# Altium schematic sheet Sheet1.SchDoc
size A3; SheetNumber: 1; SheetTotal: 1
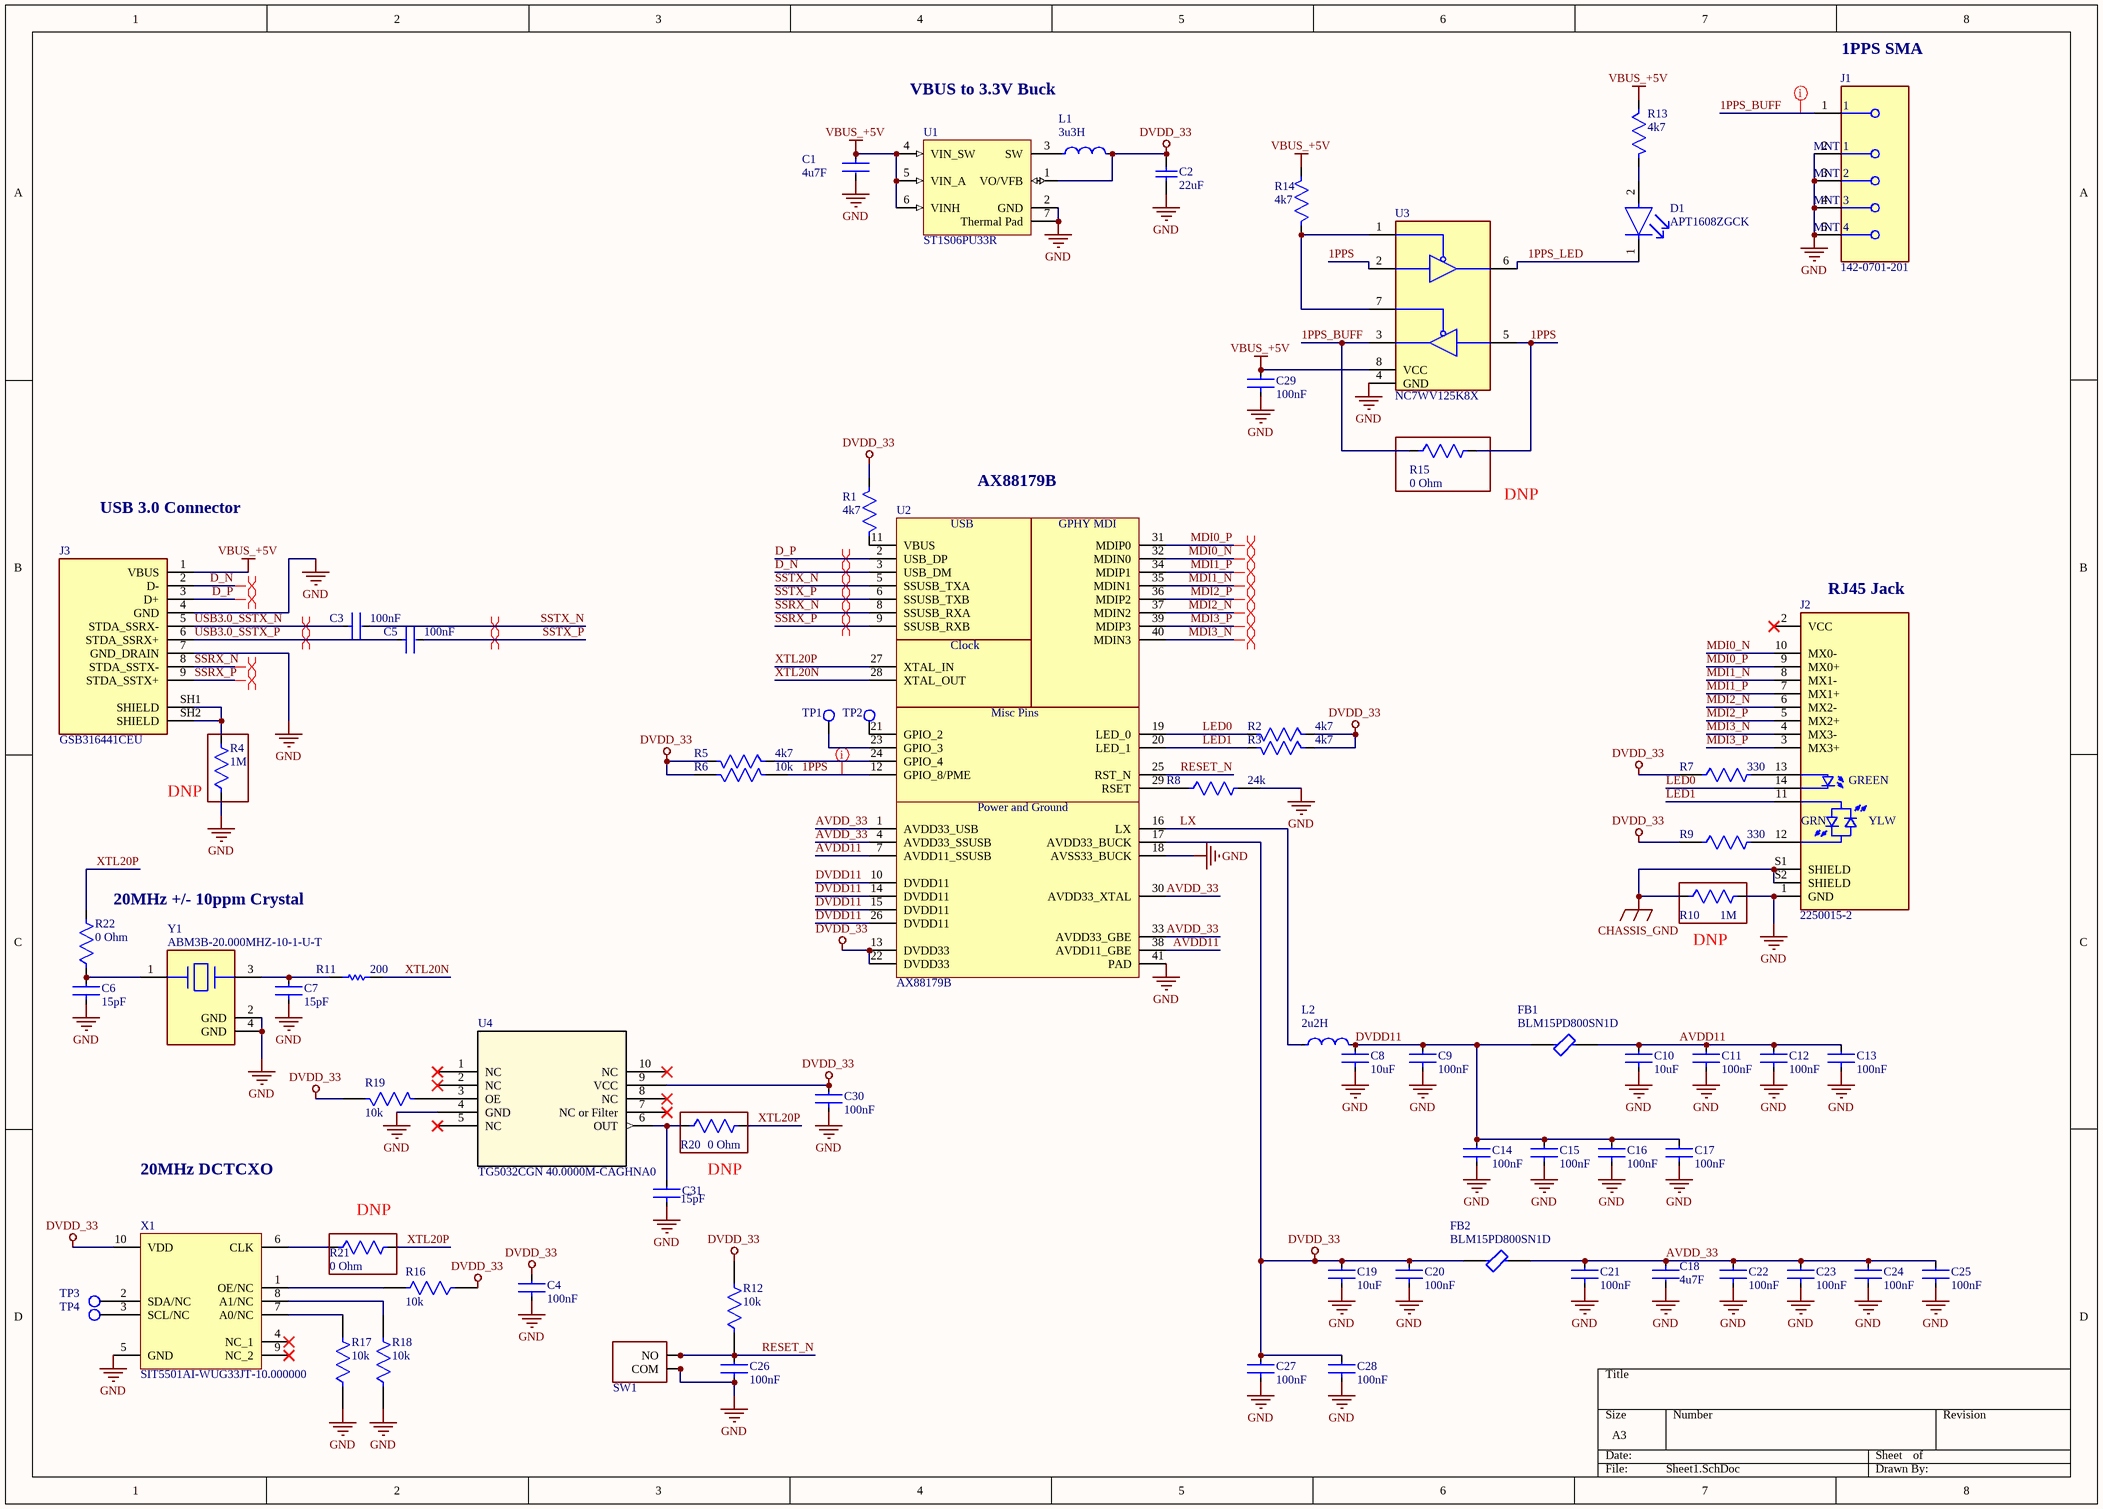
[diagram p0: Sheet1.SchDoc]

## Parts
C1  4u7F  [FP-0402-L_1_0_0_15-W_0_5-IPC_C]
C2  22uF  [CAPC1608X100X20ML10]
C3  100nF  [FP-CL251-IPC_C]
C4  100nF  [FP-CL251-IPC_C]
C5  100nF  [FP-CL251-IPC_C]
C6  15pF  [FP-CBR04C-MFG]
C7  15pF  [FP-CBR04C-MFG]
C8  10uF  [FP-CL05A106MP5NUNC-MFG]
C9  100nF  [FP-CL251-IPC_C]
C10  10uF  [FP-CL05A106MP5NUNC-MFG]
C11  100nF  [FP-CL251-IPC_C]
C12  100nF  [FP-CL251-IPC_C]
C13  100nF  [FP-CL251-IPC_C]
C14  100nF  [FP-CL251-IPC_C]
C15  100nF  [FP-CL251-IPC_C]
C16  100nF  [FP-CL251-IPC_C]
C17  100nF  [FP-CL251-IPC_C]
C18  4u7F  [FP-0402-L_1_0_0_15-W_0_5-IPC_C]
C19  10uF  [FP-CL05A106MP5NUNC-MFG]
C20  100nF  [FP-CL251-IPC_C]
C21  100nF  [FP-CL251-IPC_C]
C22  100nF  [FP-CL251-IPC_C]
C23  100nF  [FP-CL251-IPC_C]
C24  100nF  [FP-CL251-IPC_C]
C25  100nF  [FP-CL251-IPC_C]
C26  100nF  [FP-CL251-IPC_C]
C27  100nF  [FP-CL251-IPC_C]
C28  100nF  [FP-CL251-IPC_C]
C29  100nF  [FP-CL251-IPC_C]
C30  100nF  [FP-CL251-IPC_C]
C31  15pF  [FP-CBR04C-MFG]
D1  APT1608ZGCK  [FP-APT1608ZGCK-MFG]
FB1  BLM15PD800SN1D  [FP-BLM15-0_05-MFG]
FB2  BLM15PD800SN1D  [FP-BLM15-0_05-MFG]
J1  142-0701-201  [FP-142-0701-201-MFG]
J2  2250015-2  [CONN_2250015-2]
J3  GSB316441CEU  [CONN_AMPHENOL_GSB316441CEU]
L1  3u3H  [FP-LQM2HPN_G0-IPC_A]
L2  2u2H  [FP-MLZ2012-0_85-IPC_A]
R1  4k7  [FP-RT0402-MFG]
R2  4k7  [FP-RT0402-MFG]
R3  4k7  [FP-RT0402-MFG]
R4  1M  [FP-RMCF0402-MFG]  (no BOM)
R5  4k7  [FP-RT0402-MFG]
R6  10k  [FP-RMCF0402-IPC_C]
R7  330  [FP-RC1005-IPC_B]
R8  24k  [FP-RT0402-MFG]
R9  330  [FP-RC1005-IPC_B]
R10  1M  [FP-RMCF0402-MFG]  (no BOM)
R11  200  [RESC1005X40X25LL10T10]
R12  10k  [FP-RMCF0402-IPC_C]
R13  4k7  [FP-RT0402-MFG]
R14  4k7  [FP-RT0402-MFG]
R15  0 Ohm  [FP-CR0402-IPC_B]  (no BOM)
R16  10k  [FP-RMCF0402-IPC_C]
R17  10k  [FP-RMCF0402-IPC_C]
R18  10k  [FP-RMCF0402-IPC_C]
R19  10k  [FP-RMCF0402-IPC_C]
R20  0 Ohm  [FP-CR0402-IPC_B]  (no BOM)
R21  0 Ohm  [FP-CR0402-IPC_B]  (no BOM)
R22  0 Ohm  [FP-CR0402-IPC_B]
SW1  SW_PTS815_SJG_250_SMTR_LFS  [SW_PTS815SJG250SMTRLFS]  (value not drawn)
TP1  Test Point 1MM  [TP_PAD-1MM]  (value not drawn)  (no BOM)
TP2  Test Point 1MM  [TP_PAD-1MM]  (value not drawn)  (no BOM)
TP3  Test Point 1MM  [TP_PAD-1MM]  (value not drawn)  (no BOM)
TP4  Test Point 1MM  [TP_PAD-1MM]  (value not drawn)  (no BOM)
U1  ST1S06PU33R  [DFN6D_L]
U2  AX88179B  [IC_AX88179B_QFN40_5X5]
U3  NC7WV125K8X  [SOP50P310X90-8N]
U4  TG5032CGN 40.0000M-CAGHNA0  [QFN10_TG5032CGN 40.0000M-CAGHNA0_EPS]
X1  SIT5501AI-WUG33JT-10.000000  [XTAL_SiT5501_70x50]
Y1  ABM3B-20.000MHZ-10-1-U-T  [FP-ABM3B-MFG]

## Nets
CHASSIS_GND: J2.S1(SHIELD) J2.S2(SHIELD) R10.1
DVDD_33: C2.2 C4.2 C19.2 C20.2 C27.2 C28.2 C30.2 FB2.1 L1.2 R1.2 R2.1 R3.1 R5.2 R6.1 R7.1 R9.1 R12.2 R16.1 R19.1 U1.1(VO/VFB) U2.13(DVDD33) U2.17(AVDD33_BUCK) U2.22(DVDD33) U4.9(VCC) X1.10(VDD)
GND: C1.1 C2.1 C4.1 C6.2 C7.2 C8.1 C9.1 C10.1 C11.1 C12.1 C13.1 C14.1 C15.1 C16.1 C17.1 C18.1 C19.1 C20.1 C21.1 C22.1 C23.1 C24.1 C25.1 C26.1 C27.1 C28.1 C29.1 C30.1 C31.2 J1.2(MNT_1) J1.3(MNT_2) J1.4(MNT_3) J1.5(MNT_4) J2.1(GND) J3.4(GND) J3.7(GND_DRAIN) R4.1 R8.2 R10.2 R17.1 R18.1 SW1.1(COM) SW1.2(COM) U1.2(GND) U1.7(Thermal_Pad) U2.18(AVSS33_BUCK) U2.41(PAD) U3.4(GND) U4.4(GND) X1.5(GND) Y1.2(GND) Y1.4(GND)
VBUS_+5V: C1.2 C29.2 J3.1(VBUS) R13.1 R14.2 U1.4(VIN_SW) U1.5(VIN_A) U1.6(VINH) U3.8(VCC)
1PPS: R6.2 R15.2 U2.12(GPIO_8/PME) U3.2 U3.5
1PPS_BUFF: J1.1 R15.1 U3.3
1PPS_LED: D1.1(C) U3.6
AVDD11: C10.2 C11.2 C12.2 C13.2 FB1.2 U2.7(AVDD11_SSUSB) U2.38(AVDD11_GBE)
AVDD_33: C18.2 C21.2 C22.2 C23.2 C24.2 C25.2 FB2.2 U2.1(AVDD33_USB) U2.4(AVDD33_SSUSB) U2.30(AVDD33_XTAL) U2.33(AVDD33_GBE)
D_N: J3.2(D-) U2.3(USB_DM)
D_P: J3.3(D+) U2.2(USB_DP)
DVDD11: C8.2 C9.2 C14.2 C15.2 C16.2 C17.2 FB1.1 L2.2 U2.10(DVDD11) U2.14(DVDD11) U2.15(DVDD11) U2.26(DVDD11)
LED0: J2.14(GK) R2.2 U2.19(LED_0)
LED1: J2.11 R3.2 U2.20(LED_1)
LX: L2.1 U2.16(LX)
MDI0_N: J2.10(MX0-) U2.32(MDIN0)
MDI0_P: J2.9(MX0+) U2.31(MDIP0)
MDI1_N: J2.8(MX1-) U2.35(MDIN1)
MDI1_P: J2.7(MX1+) U2.34(MDIP1)
MDI2_N: J2.6(MX2-) U2.37(MDIN2)
MDI2_P: J2.5(MX2+) U2.36(MDIP2)
MDI3_N: J2.4(MX3-) U2.40(MDIN3)
MDI3_P: J2.3(MX3+) U2.39(MDIP3)
RESET_N: C26.2 R12.1 SW1.3(NO) SW1.4(NO) U2.25(RST_N)
SSRX_N: J3.8(STDA_SSTX-) U2.8(SSUSB_RXA)
SSRX_P: J3.9(STDA_SSTX+) U2.9(SSUSB_RXB)
SSTX_N: C3.2 U2.5(SSUSB_TXA)
SSTX_P: C5.2 U2.6(SSUSB_TXB)
USB3.0_SSTX_N: C3.1 J3.5(STDA_SSRX-)
USB3.0_SSTX_P: C5.1 J3.6(STDA_SSRX+)
XTL20N: R11.2 U2.28(XTAL_OUT)
XTL20P: R20.2 R21.2 R22.2 U2.27(XTAL_IN)
NetC6_1: C6.1 R22.1 Y1.1
NetC7_1: C7.1 R11.1 Y1.3
NetC31_1: C31.1 R20.1 U4.6(OUT)
NetD1_2: D1.2(A) R13.2
NetJ2_12: J2.12 R9.2
NetJ2_13: J2.13(GA) R7.2
NetJ3_SH1: J3.SH1(SHIELD) J3.SH2(SHIELD) R4.2
NetL1_1: L1.1 U1.3(SW)
NetR1_1: R1.1 U2.11(VBUS)
NetR5_1: R5.1 U2.24(GPIO_4)
NetR8_1: R8.1 U2.29(RSET)
NetR14_1: R14.1 U3.1 U3.7
NetR16_2: R16.2 X1.1(OE/NC)
NetR17_2: R17.2 X1.7(A0/NC)
NetR18_2: R18.2 X1.8(A1/NC)
NetR19_2: R19.2 U4.3(OE)
NetR21_1: R21.1 X1.6(CLK)
NetTP1_1: TP1.1 U2.23(GPIO_3)
NetTP2_1: TP2.1 U2.21(GPIO_2)
NetTP3_1: TP3.1 X1.2(SDA/NC)
NetTP4_1: TP4.1 X1.3(SCL/NC)

Not connected (* = marked no-connect by the designer): J2 2(VCC)*; U4 1(NC)* 2(NC)* 5(NC)* 7(NC_or_Filter)* 8(NC)* 10(NC)*; X1 4(NC_1)* 9(NC_2)*

## Layout directives
differential pair: D_N, D_P, SSRX_N, SSRX_P, SSTX_N, SSTX_P
differential pair; differential pair class MDI: MDI0_N, MDI0_P, MDI1_N, MDI1_P, MDI2_N, MDI2_P, MDI3_N, MDI3_P
differential pair; differential pair class USB: D_N, D_P, SSRX_N, SSRX_P, SSTX_N, SSTX_P, USB3.0_SSTX_N, USB3.0_SSTX_P
net class PPS_S50: 1PPS, 1PPS_BUFF

## Notes on the sheet
- VBUS to 3.3V Buck
- 1PPS SMA
- USB 3.0 Connector
- AX88179B
- (near R15) DNP
- (near J2) RJ45 Jack
- (near R4) DNP
- (near R22) 20MHz +/- 10ppm Crystal
- (near R10) DNP
- 20MHz DCTCXO
- DNP
- (near R21) DNP
- (in symbol CONN_2250015-2) GREEN; GRN; YLW
- (in symbol IC_AX88179B) USB; GPHY MDI; Clock; Misc Pins; Power and Ground

## Library data of the parts
C1 C18 = CMP-14477-004104-2: Ceramic Capacitor General Use 4.7uF ±20% 10V X5R 0402; Manufacturer: Taiyo Yuden; Manufacturer Part Number: LMK105BBJ475MVLF; Material: 4241ConductorMaterial; Case Code (Metric): 1005; Package Quantity: 10000; Max Operating Temperature: 85°C; Halogen Free: Halogen Free; Case Code (Imperial): 0402; Weight: 2.3E-05oz; Packaging: Tape and Reel; Resistor Type: Ceramic; Width: 0.02inch; Case/Package: 0402; Min Operating Temperature: -55°C; Dielectric: X5R; Length: 1mm; RoHS Compliant: Yes; Capacitance: 4.7uF; Thickness: 0.022inch; Termination: SMD/SMT; Voltage Rating (DC): 10V; Voltage Rating: 10V; Mount: Surface Mount; Tolerance: 20%; Height: 0.5mm; Supplier: Digikey; Supplier Part Number: 587-3408-1-ND; RoHS: Yes; Category: Ceramic Capacitors; Stock: 753964; Pricing: 1=0.19, 10=0.12, 50=0.076, 100=0.0607, 500=0.04386, 1000=0.03879, 2500=0.03711, 5000=0.03373 (USD); Mounting Technology: Surface Mount; Value: 4.7uF; Series: M; Construction: Flat; ComponentLink1URL: https://datasheet.ciiva.com/24462/423lmk105bbj475mvlf-24462535.pdf?src-supplier=Onlinecomponents.com; ComponentLink1Description: https://datasheet.ciiva.com/24462/423lmk105bbj475mvlf-24462535.pdf?src-supplier=Onlinecomponents.com; ComponentLink2URL: https://datasheet.ciiva.com/18697/mlcc-all-e-18697686.pdf?src-supplier=Digikey; ComponentLink2Description: https://datasheet.ciiva.com/18697/mlcc-all-e-18697686.pdf?src-supplier=Digikey; ComponentLink3URL: https://datasheet.ciiva.com/18697/mlcc-all-e-18697685.pdf?src-supplier=Digikey; ComponentLink3Description: https://datasheet.ciiva.com/18697/mlcc-all-e-18697685.pdf?src-supplier=Digikey
C2 = CMP-2000-05441-1: Chip Capacitor, 22 uF, +/- 20%, 10 V, -55 to 85 degC, 0603 (1608 Metric), RoHS, Tape and Reel; Manufacturer: TDK; PCN Part Number: MLCCPartNumberChange30/Nov/2012; Manufacturer Part Number: C1608X5R1A226M080AC; Voltage - Rated: 10V; Product Training Modules: CSeriesGeneralApplicationsSEAT,CCV,andTVCLDesignToolsGuidetoReplacinganElectrolyticCapacitorwithanMLCC; Other Names: 445-9077-1; Design Resources: 20WNon-IsolatedBuckLEDDriverUsingPLLNK460KG; Online Catalog: CSeries,GeneralPurpose; Capacitance: 22µF; Temperature Coefficient: X5R; Kits: 445-9014-KIT-ND-KITMLCC100PF-22UF060310-50V; Dielectric Material: Ceramic; Material: 4241ConductorMaterial; Packaging: CutTape(CT); Standard Package: 1; Package / Case: 0603(1608Metric); Lead Style: -; Features: -; Ratings: -; Operating Temperature: -55degC~85degC; Applications: GeneralPurpose; Package Reference: 603; Datasheet URL: http://download.siliconexpert.com/pdfs/2015/4/21/15/54/45/779/tdk_/manual/37024850441143360mlcc_commercial_general_en.pdf; Datasheet Version: Mar-15; Mounting Type: SurfaceMount,MLCC; Lead Spacing: -; Size / Dimension: 0.063"Lx0.031"W(1.60mmx0.80mm); Height - Seated (Max): -; Package Description: 2-Pin Surface Mount Device, Body 1.6 x 0.8 mm; Manufacturer URL: http://www.tdk.com/; RoHS Information: RoHSCertificate-MLCC; Tolerance: ±20%; Series: C; Thickness (Max): 0.035"(0.90mm); Family: CeramicCapacitors; Category: Capacitors; Supplier: Digikey; Supplier Part Number: 445-9077-1-ND; RoHS: Yes; Stock: 1433584; Pricing: 1=0.33, 10=0.219, 50=0.1612, 100=0.1312, 500=0.1036, 1000=0.08748 (USD); Mounting Technology: Surface Mount; Case/Package: 0603; Case Code (Metric): 1608; Case Code (Imperial): 0603; Weight: 7.1E-05oz; Min Operating Temperature: -55°C; Max Operating Temperature: 85°C; Voltage Rating: 10V; Value: 22uF; Voltage Rating (DC): 10V; Dielectric: X5R; Termination: SMD/SMT; Package Quantity: 4000; Length: 1.6mm; Width: 0.8mm; Height: 0.8mm; RoHS Compliant: Yes; Lead Free: Lead Free; Reach SVHC Compliant: No; ComponentLink1URL: https://datasheet.ciiva.com/6274/tdkmlcccaprange-6274860.pdf?src-supplier=Digikey; ComponentLink1Description: https://datasheet.ciiva.com/6274/tdkmlcccaprange-6274860.pdf?src-supplier=Digikey; ComponentLink2URL: https://datasheet.ciiva.com/6274/tdkmlcccaprange-6274859.pdf?src-supplier=Digikey; ComponentLink2Description: https://datasheet.ciiva.com/6274/tdkmlcccaprange-6274859.pdf?src-supplier=Digikey; ComponentLink3URL: https://datasheet.ciiva.com/6274/tdkmlcccaprange-6274861.pdf?src-supplier=Digikey; ComponentLink3Description: https://datasheet.ciiva.com/6274/tdkmlcccaprange-6274861.pdf?src-supplier=Digikey; ComponentLink4URL: https://datasheet.ciiva.com/24216/mlcc-commercial-general-en-24216575.pdf?src-supplier=Mouser; ComponentLink4Description: https://datasheet.ciiva.com/24216/mlcc-commercial-general-en-24216575.pdf?src-supplier=Mouser
C3-C5 C9 C11-C17 C20-C30 = CMP-13271-002758-1: Cap Ceramic 100nF 10V X7R ±10% SMD 0402 +125°C Paper T/R; Manufacturer: KEMET; Manufacturer Part Number: C0402C104K4RAC-TU; Voltage: 16V; Dissipation Factor: 3.5%; Voltage Rating: 10V; Voltage Rating (DC): 10V; Packaging: Tape and Reel; Radiation Hardening: No; Height: 0.5mm; Depth: 0.5mm; Package Quantity: 50000; Tolerance: 10%; Mount: Surface Mount; Width: 0.02inch; Thickness: 0.022inch; Max Operating Temperature: 125°C; Capacitance: 100nF; Dielectric: X7R; Case/Package: 0402; Length: 1mm; Min Operating Temperature: -55°C; Supplier: Digikey; Supplier Part Number: 399-C0402C104K4RAC7867CT-ND; RoHS: Yes; Category: Ceramic Capacitors; Stock: 3965396; Pricing: 1=0.1, 10=0.032, 50=0.0182, 100=0.0141, 500=0.0106, 1000=0.00833, 2500=0.00758, 5000=0.00697 (USD); Pins: 2; Case Code (Metric): 1005; Case Code (Imperial): 0402; Dielectric Material: Ceramic; Value: 100nF; Termination: SMD/SMT; Series: C; Reach SVHC Compliant: No
C6 C7 C31 = CMP-03020-019954-1: CAP CER 15PF 100V C0G/NP0 0402; Manufacturer: KEMET; Manufacturer Part Number: CBR04C150F1GAC; Tolerance: 0.01; Temperature Coefficient: 30ppm/°C; Temperature Characteristic: C0G; Material: Ceramic; Temperature Range High: +125°C; Device Class L1: Passive Components; Package: CBR04C; Height: 0.55mm; RoHS: TRUE; Octopart: https://octopart.com/cbr04c150f1gac-kemet-30609229; Value: 15 pF; Temperature Range Low: -55°C; Digikey Description: CAP CER 15PF 100V C0G/NP0 0402; Mouser Description: Multilayer Ceramic Capacitors MLCC - SMD/SMT 100volts 15pF C0G 0402 1% Tol RF; Automotive: No; Temperature: -55°C to +125°C; Category: Cap; Lead Free: Yes; Capacitance: 15 pF; Ipc Land Pattern Name: CAPC10050X50; ComponentLink2Description: Datasheet; Voltage Rating: 100 V; Device Class L3: Ceramic Capacitors; Device Class L2: Capacitors; ComponentLink2URL: https://content.kemet.com/datasheets/KEM_C1030_CBR_SMD.pdf
C8 C10 C19 = CMP-13271-000002-1: CAP CER 10UF 10V X5R 0402; Manufacturer Part Number: CL05A106MP5NUNC; Manufacturer: Samsung; Temperature Coefficient: 15%; Tolerance: 20%; Material: Ceramic; Octopart: https://octopart.com/cl05a106mp5nunc-samsung-22457395; Voltage Rating: 10V; RoHS: TRUE; Value: 10uF; Height: 0.7mm; Digikey Description: CAP CER 10UF 10V X5R 0402; Automotive: No; Package: CL05A106MP5NUNC; Device Class L1: Passive Components; Capacitance: 10uF; Temperature Range High: +85°C; ComponentLink2Description: Datasheet; Device Class L2: Capacitors; Temperature Characteristic: X5R; Temperature: -55°C to +85°C; ComponentLink2URL: http://www.samsungsem.com/kr/support/product-search/mlcc/__icsFiles/afieldfile/2019/05/10/19-CL05A106MP5NUNC.pdf; Device Class L3: Ceramic Capacitors; Category: Cap; Temperature Range Low: -55°C; Ipc Land Pattern Name: CAPC10050X50; Lead Free: Yes
D1 = CMP-44529-000024-1: LED GREEN CLEAR CHIP SMD; Manufacturer: Kingbright; Forward Voltage: 3.3V; Dominant Wavelength: 525nm; Forward Current: 20mA; Lens Color: Colorless; Viewing Angle: 120°; Luminous Intensity: 350mcd; Lens Transparency: Clear; Color: Green; Max Operating Temperature: 85°C; Case/Package: 0603; Mount: Surface Mount; Min Operating Temperature: -40°C; Case Code (Metric): 1608; Test Current: 20mA; Packaging: Tape and Reel; Width: 0.8mm; Package Quantity: 1; Height: 0.75mm; Length: 1.6mm; Illumination Color: Green; Lead Free: Lead Free; Case Code (Imperial): 0603; Supplier: LCSC; Supplier Part Number: C5554158; Manufacturer Part Number: APT1608ZGCK; RoHS: Yes; Category: LEDs; Stock: 1770; Pricing: 5=0.3043, 50=0.2442, 150=0.2184, 500=0.1863, 2000=0.1719, 4000=0.1633 (USD); Mounting Technology: Surface Mount; Series: HELI2; RoHS Compliant: Yes; ComponentLink1URL: https://datasheet.ciiva.com/16422/apt1608zgck-262051-16422477.pdf?src-supplier=Mouser; ComponentLink1Description: https://datasheet.ciiva.com/16422/apt1608zgck-262051-16422477.pdf?src-supplier=Mouser; ComponentLink2URL: https://datasheet.ciiva.com/26292/apt1608zgck-26292289.pdf?src-supplier=Digikey; ComponentLink2Description: https://datasheet.ciiva.com/26292/apt1608zgck-26292289.pdf?src-supplier=Digikey; ComponentLink3URL: https://datasheet.ciiva.com/29562/apt1608zgck-29562277.pdf?src-supplier=Digikey; ComponentLink3Description: https://datasheet.ciiva.com/29562/apt1608zgck-29562277.pdf?src-supplier=Digikey
FB1 FB2 = CMP-0686-00284-4: Chip Ferrite Bead, 0402, 80Ω @ 100MHz, 0.07Ω, 25%, 1.5A; Manufacturer: Murata; Number of Lines: 1; DC Resistance-Max: 70mR; Impedance: 80R; Height: 0.5mm; Package Quantity: 1; RoHS Compliant: Yes; Max Operating Temperature: 125°C; Depth: 0.5mm; Max Current Rating: 1.5A; Max DC Current: 1.5A; Current Rating: 1.5A; Number of Pins: 2; Case Code (Imperial): 0402; Case/Package: 0402; Case Code (Metric): 1005; Material: Ferrite; Packaging: Tape and Reel; REACH SVHC: No SVHC; Length: 1mm; Tolerance: 25%; Termination: SMD/SMT; Series: BLM15PD; Number of Circuits: 1; Test Frequency: 100MHz; DC Resistance (DCR): 70mR; Min Operating Temperature: -55°C; Lead Free: Lead Free; Width: 0.5mm; Supplier: Digikey; Supplier Part Number: 490-5202-1-ND; Manufacturer Part Number: BLM15PD800SN1D; RoHS: Yes; Category: Ferrite Beads and Chips; Stock: 94761; Pricing: 1=0.1, 10=0.068, 25=0.0616, 50=0.0556, 100=0.0408, 250=0.02968, 500=0.0272, 1000=0.02348, 5000=0.01854 (USD); Pins: 2; Reach SVHC Compliant: No; ComponentLink1URL: https://datasheet.ciiva.com/41449/001172208-da-01-en-drossel-0402-80r-1-0x0-5mm-10000st-41449497.pdf?src-supplier=Conrad; ComponentLink1Description: https://datasheet.ciiva.com/41449/001172208-da-01-en-drossel-0402-80r-1-0x0-5mm-10000st-41449497.pdf?src-supplier=Conrad; ComponentLink2URL: https://datasheet.ciiva.com/1012/l0110e-1012441.pdf?src-supplier=Digikey; ComponentLink2Description: https://datasheet.ciiva.com/1012/l0110e-1012441.pdf?src-supplier=Digikey; ComponentLink3URL: https://datasheet.ciiva.com/1012/l0110e-1012440.pdf?src-supplier=Digikey; ComponentLink3Description: https://datasheet.ciiva.com/1012/l0110e-1012440.pdf?src-supplier=Digikey; ComponentLink4URL: https://datasheet.ciiva.com/1012/l0110e-1012442.pdf?src-supplier=Digikey; ComponentLink4Description: https://datasheet.ciiva.com/1012/l0110e-1012442.pdf?src-supplier=Digikey; ComponentLink5URL: https://datasheet.ciiva.com/16420/l0110s0100blm15pgblm15pd-16420757.pdf?src-supplier=Future+Electronics; ComponentLink5Description: https://datasheet.ciiva.com/16420/l0110s0100blm15pgblm15pd-16420757.pdf?src-supplier=Future+Electronics
J1 = CMP-09588-000003-1: CONN SMA JACK STR 50 OHM PCB; Manufacturer: Bel Cinch; Voltage Rating: 335V; Body Plating: Gold; Operating Frequency: 0 to 18 GHz; Frequency: 18GHz; Gender: Male; Impedance: 50R; Max Operating Temperature: 165°C; Fastening Type: Threaded; Orientation: Straight; Package Quantity: 5; Contact Plating: Gold; Max Frequency: 18GHz; Mount: Through Hole; RoHS Compliant: Yes; Packaging: Bulk; Termination: Solder; Case/Package: SMA; Radiation Hardening: No; Series: SMA; Min Operating Temperature: -65°C; Connector Type: SMA; Contact Material: Copper; Supplier: Digikey; Supplier Part Number: J500-ND; Manufacturer Part Number: 142-0701-201; RoHS: Yes; Category: RF / Coaxial Connectors; Stock: 9658; Pricing: 1=4.03, 10=3.663, 25=3.4692, 50=3.3884, 100=3.2271, 250=2.82372, 500=2.74304, 1000=2.33966, 2500=2.1783 (USD); Mounting Technology: Through Hole; Clock Frequency: 18GHz; Reach SVHC Compliant: Unknown; ComponentLink1URL: https://datasheet.ciiva.com/643/dr-1420701206-643288.pdf?src-supplier=Digikey; ComponentLink1Description: https://datasheet.ciiva.com/643/dr-1420701206-643288.pdf?src-supplier=Digikey; ComponentLink2URL: https://datasheet.ciiva.com/23769/pi-1420701201-23769366.pdf?src-supplier=Newark; ComponentLink2Description: https://datasheet.ciiva.com/23769/pi-1420701201-23769366.pdf?src-supplier=Newark; ComponentLink3URL: https://datasheet.ciiva.com/3131/pi-142-0701-201-3131251.pdf?src-supplier=Avnet; ComponentLink3Description: https://datasheet.ciiva.com/3131/pi-142-0701-201-3131251.pdf?src-supplier=Avnet; ComponentLink4URL: https://datasheet.ciiva.com/16776/142-0701-201-16776554.pdf?src-supplier=Future+Electronics; ComponentLink4Description: https://datasheet.ciiva.com/16776/142-0701-201-16776554.pdf?src-supplier=Future+Electronics; ComponentLink5URL: https://datasheet.ciiva.com/30080/pi-142-0701-201-30080563.pdf?src-supplier=Onlinecomponents.com; ComponentLink5Description: https://datasheet.ciiva.com/30080/pi-142-0701-201-30080563.pdf?src-supplier=Onlinecomponents.com
J2 = CONN_2250015-2: Modular Connectors / Ethernet Connectors 1X1 MAG45 GIG 7G140ET TAB W/ LEDS; Manufacturer: Bel; MF: TRP Connector; Connector Type: RJ45; Direction: Up; Number of Ports: 1; Number of Cores per Jack: 8; Shielding: Shielded; MP: 2250015-2; Price: None; Availability: Warning; SnapEDA_Link: https://www.snapeda.com/parts/2250015-2/TRP%20Connector/view-part/4423750/?ref=snap; Value: *; Package: None; Purchase-URL: https://pricing.snapeda.com/search/part/2250015-2/?ref=eda; Check_prices: https://www.snapeda.com/parts/2250015-2/TRP%20Connector/view-part/4423750/?ref=eda; Supplier: Mouser; Supplier Part Number: 530-2250015-2; Manufacturer Part Number: 2250015-2; RoHS: Yes; Category: Modular / Ethernet Connectors; Stock: 1265; Pricing: 1=10.04, 10=9.04, 50=7.55, 100=7.41, 1000=6.08, 10000=5.8 (USD); Mounting Technology: Through Hole; Contact Material: Bronze; Contact Plating: Gold; Color: Green,Yellow; Housing Material: Thermoplastic; Min Operating Temperature: -40°C; Max Operating Temperature: 85°C; Series: MagJack®; Termination: Solder; Packaging: Tray; Number of Rows: 1; RoHS Compliant: Yes; ComponentLink1URL: http://belfuse.com/resources/brochures/magneticsolutions/br-mag-magjack-icm.pdf?src-supplier=Digikey; ComponentLink1Description: http://belfuse.com/resources/brochures/magneticsolutions/br-mag-magjack-icm.pdf?src-supplier=Digikey; ComponentLink2URL: https://datasheet.octopart.com/2250015-2-Bel-Fuse-datasheet-137332709.pdf?src-supplier=Sager+Electronics; ComponentLink2Description: https://datasheet.octopart.com/2250015-2-Bel-Fuse-datasheet-137332709.pdf?src-supplier=Sager+Electronics
J3 = CONN_GSB316441CEU: Conn USB 3.0 Type A PL 9 POS Solder RA SMD 9 Terminal 1 Port; Manufacturer: Amphenol Commercial; MF: Amphenol; Current Rating: 1.8A; Number of Contacts: 9; SnapEDA_Link: https://www.snapeda.com/parts/GSB316441CEU/Amphenol/view-part/?ref=snap; Package: None; Value: *; MP: GSB316441CEU; Check_prices: https://www.snapeda.com/parts/GSB316441CEU/Amphenol/view-part/?ref=eda; Supplier: Digikey; Supplier Part Number: GSB316441CEUCT-ND; Manufacturer Part Number: GSB316441CEU; RoHS: Yes; Category: USB Connectors; Stock: 13312; Pricing: 1=2.04, 10=1.775, 25=1.6996, 50=1.6618, 100=1.5863, 250=1.43524 (USD); Mounting Technology: Surface Mount,Horizontal; Contact Material: Copper Alloy; Contact Plating: Gold; Package Quantity: 1; Packaging: Tape and Reel; Connector Type: USB; Termination: SMD/SMT; Orientation: Right Angle; Series: GSB3; Radiation Hardening: No; RoHS Compliant: Yes; ComponentLink1URL: https://datasheet.ciiva.com/10945/gsb316441ceu-10945197.pdf?src-supplier=Avnet; ComponentLink1Description: https://datasheet.ciiva.com/10945/gsb316441ceu-10945197.pdf?src-supplier=Avnet; Supplier 1: Digikey; Supplier Part Number 1: GSB316441CEUCT-ND
L1 = CMP-06042-016211-1: Multilayer Type Inductor for Power Lines, 1008 (2520), 3.3μH, 20%, 0.125Ω, 1.2A; Manufacturer: Murata; Manufacturer Part Number: LQM2HPN3R3MG0L; Self Resonant Frequency: 30MHz; Inductance: 3.3uH; Shielding: Shielded; DC Resistance (DCR): 125mR; Test Frequency: 1MHz; Core Material: Ferrite; Value: 3.3uH; Case Code (Imperial): 1008; Width: 2mm; Lead Free: Lead Free; Inductance Tolerance: 20%; Radiation Hardening: No; Mount: Surface Mount; Packaging: Tape and Reel; Case Code (Metric): 2520; Height: 0.9mm; Military Standard: Not; Tolerance: 20%; Max DC Current: 1.2A; Min Operating Temperature: -55°C; Length: 2.5mm; Depth: 2.2mm; Case/Package: 1008; Max Operating Temperature: 125°C; Series: LQM2HP_G0; RoHS Compliant: Yes; Height - Seated (Max): 0.039inch; REACH SVHC: No SVHC; DC Current: 1.2A; Package Quantity: 3000; Termination: SMD/SMT; Current Rating: 1.2A; Supplier: Digikey; Supplier Part Number: 490-5115-1-ND; RoHS: Yes; Category: Fixed Inductors; Stock: 32510; Pricing: 1=0.21, 10=0.171, 25=0.1576, 50=0.1444, 100=0.1274, 250=0.12344, 500=0.11032, 1000=0.0893 (USD); Mounting Technology: Surface Mount; Reach SVHC Compliant: No; ComponentLink1URL: https://datasheet.ciiva.com/30490/0900766b812561d9-30490184.pdf?src-supplier=Rs; ComponentLink1Description: https://datasheet.ciiva.com/30490/0900766b812561d9-30490184.pdf?src-supplier=Rs; ComponentLink2URL: https://datasheet.ciiva.com/1042/l0075s0104lqm2hp-g0-1042940.pdf?src-supplier=Digikey; ComponentLink2Description: https://datasheet.ciiva.com/1042/l0075s0104lqm2hp-g0-1042940.pdf?src-supplier=Digikey; ComponentLink3URL: https://datasheet.ciiva.com/1042/l0075s0104lqm2hp-g0-1042941.pdf?src-supplier=Digikey; ComponentLink3Description: https://datasheet.ciiva.com/1042/l0075s0104lqm2hp-g0-1042941.pdf?src-supplier=Digikey; ComponentLink4URL: https://datasheet.ciiva.com/1042/l0075s0104lqm2hp-g0-1042942.pdf?src-supplier=Digikey; ComponentLink4Description: https://datasheet.ciiva.com/1042/l0075s0104lqm2hp-g0-1042942.pdf?src-supplier=Digikey; ComponentLink5URL: https://datasheet.ciiva.com/8509/l0075s0104lqm2hp-g0-8509087.pdf?src-supplier=Avnet; ComponentLink5Description: https://datasheet.ciiva.com/8509/l0075s0104lqm2hp-g0-8509087.pdf?src-supplier=Avnet
L2 = CMP-08253-000395-1: Shielded Multilayer Inductor 2.2uH ±20% 800mA 156mΩ SMD 0805; Manufacturer: TDK; Manufacturer Part Number: MLZ2012N2R2LT000; Core Material: Ferrite; Test Frequency: 2MHz; Self Resonant Frequency: 120MHz; Saturation Current: 170mA; DC Resistance (DCR): 156mR; Mount: Surface Mount; Tolerance: 20%; Length: 0.079inch; Packaging: Tape and Reel; Inductance: 2.2uH; Current Rating: 800mA; Min Operating Temperature: -55°C; Case Code (Metric): 2012; Shielding: Shielded; Max Operating Temperature: 125°C; Width: 0.049inch; Case/Package: 0805; RoHS Compliant: Yes; Height - Seated (Max): 0.041inch; Package Quantity: 1; Case Code (Imperial): 0805; Supplier: Digikey; Supplier Part Number: 445-6758-1-ND; RoHS: Yes; Category: Fixed Inductors; Stock: 32581; Pricing: 1=0.12, 10=0.095, 25=0.0876, 50=0.0772, 100=0.0676, 250=0.06436, 500=0.06052, 1000=0.04635 (USD); Mounting Technology: Surface Mount; Value: 2.2uH; Series: MLZ; ComponentLink1URL: https://datasheet.ciiva.com/29698/inductor-commercial-decoupling-mlz-en-29698919.pdf?src-supplier=Digikey; ComponentLink1Description: https://datasheet.ciiva.com/29698/inductor-commercial-decoupling-mlz-en-29698919.pdf?src-supplier=Digikey; ComponentLink2URL: https://datasheet.ciiva.com/29698/inductor-commercial-decoupling-mlz-en-29698920.pdf?src-supplier=Digikey; ComponentLink2Description: https://datasheet.ciiva.com/29698/inductor-commercial-decoupling-mlz-en-29698920.pdf?src-supplier=Digikey; ComponentLink3URL: https://datasheet.ciiva.com/29698/inductor-commercial-decoupling-mlz-en-29698918.pdf?src-supplier=Digikey; ComponentLink3Description: https://datasheet.ciiva.com/29698/inductor-commercial-decoupling-mlz-en-29698918.pdf?src-supplier=Digikey
R1-R3 R5 R13 R14 = CMP-2002-02814-2: RES SMD 4.7K OHM 0.1% 1/16W 0402; Manufacturer: Yageo; Manufacturer Part Number: RT0402BRD074K7L; Voltage Rating: 50V; Temperature Coefficient: 25 ppm/°C; Resistance: 4.7KΩ; Tolerance: 0.001; Power Rating: 0.063W; Value: 4.7KΩ; Device Class L2: Resistors; Composition: Thin Film; Octopart: https://octopart.com/rt0402brd074k7l-yageo-1415343; Mouser Description: Thin Film Resistors 1/16W 4.7K ohm .1% 25ppm; Lead Free: Yes; Height: 0.35mm; Automotive: No; Series: RT; Ipc Land Pattern Name: RESC10050X30; Package: RT0402; Category: Res; Temperature Range High: +155°C; Footprint Url: http://www.yageo.com/exep/pages/download/literatures/PYu-R_Mount_10.pdf; Temperature Range Low: -55°C; Device Class L3: Chip SMD Resistors; RoHS: TRUE; ComponentLink2URL: http://www.yageo.com/documents/recent/PYu-RT_1-to-0.01_RoHS_L_9.pdf; Digikey Description: RES SMD 4.7K OHM 0.1% 1/16W 0402; Temperature: -55°C to +155°C; Device Class L1: Passive Components; ComponentLink2Description: Datasheet
R4 R10 = CMP-26527-001513-1: 1MΩ ±5% 0.063W 0402 Thick Film Chip Resistor AEC-Q200 compliant; Manufacturer: Stackpole Electronics; Manufacturer Part Number: RMCF0402JT1M00; Power Rating: 63mW; Temperature Coefficient: 100ppm/°C; Resistance: 1MR; Working Voltage: 50V; Value: 1MR; Number of Terminations: 2; Resistor Type: Thick Film; Case/Package: 0402; Length: 0.039inch; Min Operating Temperature: -55°C; Mount: Surface Mount; Max Operating Temperature: 155°C; Depth: 0.5mm; Height: 0.016inch; Tolerance: 5%; RoHS Compliant: Yes; Construction: Rectangular; Contact Plating: Tin; Case Code (Imperial): 0402; Features: Automotive AEC-Q200; Radiation Hardening: No; Military Standard: Not; Case Code (Metric): 1005; Max Power Dissipation: 63mW; Packaging: Tape and Reel; Series: RMCF; Lead Free: Lead Free; Technology: THICK FILM; Width: 0.02inch; Supplier: Digikey; Supplier Part Number: RMCF0402JT1M00CT-ND; RoHS: Yes; Category: Chip SMD Resistors; Stock: 22890; Pricing: 1=0.1, 10=0.016, 50=0.009, 100=0.0072, 500=0.00462, 1000=0.00389, 5000=0.00269 (USD); Mounting Technology: Surface Mount; ComponentLink1URL: https://datasheet.ciiva.com/26946/getdatasheetpartid-791049-26946706.pdf?src-supplier=Verical; ComponentLink1Description: https://datasheet.ciiva.com/26946/getdatasheetpartid-791049-26946706.pdf?src-supplier=Verical
R6 R12 R16-R19 = CMP-26527-000128-1: 10kΩ ±1% 0.063W 0402 Thick Film Chip Resistor AEC-Q200 compliant; Manufacturer: Stackpole Electronics; Manufacturer Part Number: RMCF0402FT10K0; Temperature Coefficient: 100ppm/°C; Power Rating: 62.5mW; Resistance: 10kR; Max Power Dissipation: 63mW; Value: 10kR; Width: 0.02inch; Case/Package: 0402; Depth: 0.5mm; Resistor Type: Thick Film; Series: RMCF; Length: 1mm; Contact Plating: Tin; Tolerance: 1%; Number of Terminations: 2; Height: 0.016inch; Military Standard: Not; Case Code (Imperial): 0402; Size Code: 0402; Construction: Rectangular; Radiation Hardening: No; RoHS Compliant: Yes; Case Code (Metric): 1005; Packaging: Tape and Reel; Lead Free: Lead Free; Min Operating Temperature: -55°C; Max Operating Temperature: 155°C; Mount: Surface Mount; Features: Automotive AEC-Q200; Supplier: Digikey; Supplier Part Number: RMCF0402FT10K0CT-ND; RoHS: Yes; Category: Chip SMD Resistors; Stock: 16567212; Pricing: 1=0.1, 10=0.021, 50=0.0116, 100=0.0093, 500=0.00594, 1000=0.005, 5000=0.00345 (USD); Mounting Technology: Surface Mount; Ratings: AEC-Q200; ComponentLink1URL: https://datasheet.ciiva.com/24341/sei-rmcp-24341800.pdf?src-supplier=Onlinecomponents.com; ComponentLink1Description: https://datasheet.ciiva.com/24341/sei-rmcp-24341800.pdf?src-supplier=Onlinecomponents.com
R7 R9 = CMP-13261-004965-1: Res Thick Film 0402 330Ω 1% 0.063W ±100ppm/°C Molded SMD T/R; Manufacturer: Samsung; Manufacturer Part Number: RC1005F331CS; Resistance: 330R; Max Power Dissipation: 63mW; Value: 330R; Contact Plating: Tin; Case/Package: 0402; Width: 0.02inch; Min Operating Temperature: -55°C; Composition: Thick Film; Package Quantity: 1; Length: 0.039inch; Case Code (Imperial): 0402; Case Code (Metric): 1005; Height: 0.016inch; Features: Moisture Resistant; Radiation Hardening: No; Military Standard: Not; Depth: 0.5mm; Temperature Coefficient: 100ppm/°C; Max Operating Temperature: 155°C; Packaging: Tape and Reel; Tolerance: 1%; Number of Terminations: 2; Power Rating: 63mW; Supplier: Digikey; Supplier Part Number: 1276-3976-1-ND; RoHS: Yes; Category: Chip SMD Resistors; Stock: 6645; Pricing: 1=0.1, 10=0.034, 50=0.0224, 100=0.0188, 500=0.01312, 1000=0.01142, 5000=0.0085 (USD); Series: RC; RoHS Compliant: Yes; ComponentLink1URL: https://datasheet.ciiva.com/16481/rc-series-16481001.pdf?src-supplier=Future+Electronics; ComponentLink1Description: https://datasheet.ciiva.com/16481/rc-series-16481001.pdf?src-supplier=Future+Electronics
R8 = CMP-2002-03028-2: RES SMD 24K OHM 1% 1/16W 0402; Manufacturer Part Number: RT0402FRE0724KL; Manufacturer: Yageo; Power Rating: 0.063W; Tolerance: 0.01; Voltage Rating: 50V; Value: 24KΩ; Temperature Coefficient: 50 ppm/°C; Automotive: No; Ipc Land Pattern Name: RESC10050X30; Footprint Url: http://www.yageo.com/exep/pages/download/literatures/PYu-R_Mount_10.pdf; Category: Res; Height: 0.35mm; RoHS: TRUE; Lead Free: Yes; Device Class L1: Passive Components; Series: RT; Package: RT0402; Device Class L2: Resistors; ComponentLink2URL: http://www.yageo.com/documents/recent/PYu-RT_1-to-0.01_RoHS_L_9.pdf; Temperature Range High: +155°C; Digikey Description: RES SMD 24K OHM 1% 1/16W 0402; Temperature: -55°C to +155°C; Octopart: https://octopart.com/rt0402fre0724kl-yageo-1380387; Resistance: 24KΩ; Composition: Thin Film; Device Class L3: Chip SMD Resistors; ComponentLink2Description: Datasheet; Temperature Range Low: -55°C
R11 = CMP-2002-03738-1: Manufacturer: KOA Speer; Part Number: RK73B1ETTP201J; Value: 200R; Tolerance: 5%; Power Rating: 63mW; Temperature Coefficient: 200ppm/°C; Voltage Rating: 50V; Supplier: Digikey; Supplier Part Number: 2019-RK73B1ETTP201JCT-ND; Manufacturer Part Number: RK73B1ETTP201J; RoHS: Yes; Category: Chip SMD Resistors; Stock: 533194; Pricing: 1=0.1, 10=0.017, 50=0.0104, 100=0.0087, 500=0.0058, 1000=0.00494, 5000=0.00355 (USD); Mounting Technology: Surface Mount; Case/Package: 0402; Case Code (Imperial): 0402; Case Code (Metric): 1005; Min Operating Temperature: -55°C; Max Operating Temperature: 155°C; Packaging: Tape and Reel; Series: RK73B; Voltage Rating (DC): 50V; Package Quantity: 10000; Termination: SMD/SMT; Construction: Rectangular; Technology: THICK FILM; Length: 1mm; Width: 0.5mm; Height: 0.35mm; Depth: 0.5mm; RoHS Compliant: Yes; Lead Free: Lead Free; Military Standard: MIL-R-55342F; ComponentLink1URL: https://datasheet.ciiva.com/27054/1876901-27054398.pdf?src-supplier=Jameco; ComponentLink1Description: https://datasheet.ciiva.com/27054/1876901-27054398.pdf?src-supplier=Jameco; ComponentLink2URL: https://datasheet.ciiva.com/15202/getdatasheetpartid-170798-15202604.pdf?src-supplier=Verical; ComponentLink2Description: https://datasheet.ciiva.com/15202/getdatasheetpartid-170798-15202604.pdf?src-supplier=Verical; ComponentLink3URL: https://datasheet.ciiva.com/5555/rk73b-5555653.pdf?src-supplier=Mouser; ComponentLink3Description: https://datasheet.ciiva.com/5555/rk73b-5555653.pdf?src-supplier=Mouser
R15 R20-R22 = CMP-2002-05495-2: Thick Film Chip Resistors 0402 0Ω 0.0625W 5%; Manufacturer: Bourns; Manufacturer Part Number: CR0402-J/-000GLF; Manufacturer Series: CR0402; Voltage Rating (DC): 50V; Max Power Dissipation: 63mW; Temperature Coefficient: 500ppm/°C; Resistance: 0mR; Power Rating: 62.5mW; Value: 0R; Depth: 0.5mm; Packaging: Tape and Reel; REACH SVHC: No SVHC; Max Operating Temperature: 125°C; Case Code (Metric): 1005; Case Code (Imperial): 0402; Case/Package: 0402; Number of Pins: 2; Thickness: 356um; Composition: Thick Film; Voltage Rating: 50V; Min Operating Temperature: -55°C; Tolerance: 5%; Radiation Hardening: No; Height: 0.35mm; Termination: SMD/SMT; Width: 0.5mm; Mount: Surface Mount; Package Quantity: 10000; Contact Plating: Tin; Length: 1mm; Supplier: LCSC; Supplier Part Number: C203078; RoHS: Yes; Category: Chip SMD Resistors; Stock: 2300; Pricing: 100=0.004, 1000=0.0033, 3000=0.0029, 10000=0.0026, 50000=0.0024, 100000=0.0023 (USD); Mounting Technology: Surface Mount; Pins: 2NUMBER; Package Shape: Rectangular; Terminal Finish: Tin; Resistor Type: Thick Film; Series: CR0402; Number of Terminations: 2; Resistance Tolerance: 5%; Technology: THICK FILM; RoHS Compliant: Yes; Reach SVHC Compliant: No; ComponentLink1URL: https://datasheet.ciiva.com/11811/0900766b80fcdb41-11811721.pdf?src-supplier=Rs; ComponentLink1Description: https://datasheet.ciiva.com/11811/0900766b80fcdb41-11811721.pdf?src-supplier=Rs; ComponentLink2URL: https://datasheet.ciiva.com/19466/774727-19466474.pdf?src-supplier=Jameco; ComponentLink2Description: https://datasheet.ciiva.com/19466/774727-19466474.pdf?src-supplier=Jameco; ComponentLink3URL: https://datasheet.ciiva.com/7986/cr0402-7986154.pdf?src-supplier=Element14; ComponentLink3Description: https://datasheet.ciiva.com/7986/cr0402-7986154.pdf?src-supplier=Element14; ComponentLink4URL: https://datasheet.ciiva.com/9116/cr0402-9116774.pdf?src-supplier=Avnet; ComponentLink4Description: https://datasheet.ciiva.com/9116/cr0402-9116774.pdf?src-supplier=Avnet; ComponentLink5URL: https://datasheet.ciiva.com/6549/cr0402-6549983.pdf?src-supplier=Digikey; ComponentLink5Description: https://datasheet.ciiva.com/6549/cr0402-6549983.pdf?src-supplier=Digikey; ComponentLink6URL: https://datasheet.ciiva.com/30262/cr0402-30262110.pdf?src-supplier=Onlinecomponents.com; ComponentLink6Description: https://datasheet.ciiva.com/30262/cr0402-30262110.pdf?src-supplier=Onlinecomponents.com
SW1 = SW_PTS815_SJG_250_SMTR_LFS: Switch Tactile N.O. SPST Button J-Bend 0.05A 12VDC 3.92N SMD T/R; Manufacturer: ITT C&K; Manufacturer Part Number: PTS815SJG250SMTRLFS; MF: C&K; MP: PTS815 SJG 250 SMTR LFS; Mechanical Life: 100000Cycles; Illumination Type: Non-Illuminated; Switch Function: Off-Mom; Operating Force: 400gf; Switch Travel: 0.2mm; Ratings: IP40; SnapEDA_Link: https://www.snapeda.com/parts/PTS815%20SJG%20250%20SMTR%20LFS/C%2526K/view-part/?ref=snap; Package: None; Value: *; Check_prices: https://www.snapeda.com/parts/PTS815%20SJG%20250%20SMTR%20LFS/C%2526K/view-part/?ref=eda; Supplier: Digikey; Supplier Part Number: CKN12217-1-ND; RoHS: Yes; Category: Tactile Switches; Stock: 38609; Pricing: 1=0.25, 10=0.246, 25=0.2332, 100=0.2113, 250=0.1926, 500=0.17902, 1000=0.15271 (USD); Mounting Technology: Surface Mount; Min Operating Temperature: -20°C; Max Operating Temperature: 70°C; Throw Configuration: SPST; Series: PTS815; Packaging: Cut Tape; ComponentLink1URL: http://datasheet.octopart.com/PTS815SJG250SMTRLFS-C%26K-Components-datasheet-130077068.pdf?src-supplier=Future+Electronics; ComponentLink1Description: http://datasheet.octopart.com/PTS815SJG250SMTRLFS-C%26K-Components-datasheet-130077068.pdf?src-supplier=Future+Electronics; ComponentLink2URL: http://datasheet.octopart.com/PTS815SJG250SMTRLFS-C%26K-Components-datasheet-130077068.pdf?src-supplier=Farnell; ComponentLink2Description: http://datasheet.octopart.com/PTS815SJG250SMTRLFS-C%26K-Components-datasheet-130077068.pdf?src-supplier=Farnell; ComponentLink3URL: http://datasheet.octopart.com/PTS815SJG250SMTRLFS-C%26K-Components-datasheet-130077068.pdf?src-supplier=Arrow+Electronics; ComponentLink3Description: http://datasheet.octopart.com/PTS815SJG250SMTRLFS-C%26K-Components-datasheet-130077068.pdf?src-supplier=Arrow+Electronics; ComponentLink4URL: http://datasheet.octopart.com/PTS815SJG250SMTRLFS-C%26K-Components-datasheet-130077068.pdf?src-supplier=Mouser; ComponentLink4Description: http://datasheet.octopart.com/PTS815SJG250SMTRLFS-C%26K-Components-datasheet-130077068.pdf?src-supplier=Mouser; ComponentLink5URL: http://datasheet.octopart.com/PTS815SJG250SMTRLFS-C%26K-Components-datasheet-130077068.pdf?src-supplier=Newark; ComponentLink5Description: http://datasheet.octopart.com/PTS815SJG250SMTRLFS-C%26K-Components-datasheet-130077068.pdf?src-supplier=Newark; ComponentLink6URL: http://datasheet.octopart.com/PTS815SJG250SMTRLFS-C%26K-Components-datasheet-130077068.pdf?src-supplier=Avnet; ComponentLink6Description: http://datasheet.octopart.com/PTS815SJG250SMTRLFS-C%26K-Components-datasheet-130077068.pdf?src-supplier=Avnet; ComponentLink7URL: http://datasheet.octopart.com/PTS815SJG250SMTRLFS-C%26K-Components-datasheet-130077068.pdf?src-supplier=Allied+Electronics; ComponentLink7Description: http://datasheet.octopart.com/PTS815SJG250SMTRLFS-C%26K-Components-datasheet-130077068.pdf?src-supplier=Allied+Electronics; ComponentLink8URL: http://datasheet.octopart.com/PTS815SJG250SMTRLFS-C%26K-Components-datasheet-130077068.pdf?src-supplier=Digikey; ComponentLink8Description: http://datasheet.octopart.com/PTS815SJG250SMTRLFS-C%26K-Components-datasheet-130077068.pdf?src-supplier=Digikey; ComponentLink9URL: http://datasheet.octopart.com/PTS815SJG250SMTRLFS-C%26K-Components-datasheet-130077068.pdf?src-supplier=Verical; ComponentLink9Description: http://datasheet.octopart.com/PTS815SJG250SMTRLFS-C%26K-Components-datasheet-130077068.pdf?src-supplier=Verical; ComponentLink10URL: http://datasheet.octopart.com/PTS815SJG250SMTRLFS-C%26K-Components-datasheet-130077068.pdf?src-supplier=Onlinecomponents.com; ComponentLink10Description: http://datasheet.octopart.com/PTS815SJG250SMTRLFS-C%26K-Components-datasheet-130077068.pdf?src-supplier=Onlinecomponents.com; ComponentLink11URL: http://datasheet.octopart.com/PTS815SJG250SMTRLFS-C%26K-Components-datasheet-130077068.pdf?src-supplier=LCSC; ComponentLink11Description: http://datasheet.octopart.com/PTS815SJG250SMTRLFS-C%26K-Components-datasheet-130077068.pdf?src-supplier=LCSC; ComponentLink12URL: http://datasheet.octopart.com/PTS815SJG250SMTRLFS-C%26K-Components-datasheet-130077068.pdf?src-supplier=TTI; ComponentLink12Description: http://datasheet.octopart.com/PTS815SJG250SMTRLFS-C%26K-Components-datasheet-130077068.pdf?src-supplier=TTI; ComponentLink13URL: http://datasheet.octopart.com/PTS815SJG250SMTRLFS-C%26K-Components-datasheet-130077068.pdf?src-supplier=Sager+Electronics; ComponentLink13Description: http://datasheet.octopart.com/PTS815SJG250SMTRLFS-C%26K-Components-datasheet-130077068.pdf?src-supplier=Sager+Electronics; ComponentLink14URL: http://datasheet.octopart.com/PTS815SJG250SMTRLFS-C%26K-Components-datasheet-130077068.pdf?src-supplier=Electro+Sonic; ComponentLink14Description: http://datasheet.octopart.com/PTS815SJG250SMTRLFS-C%26K-Components-datasheet-130077068.pdf?src-supplier=Electro+Sonic; ComponentLink15URL: http://datasheet.octopart.com/PTS815SJG250SMTRLFS-C%26K-Components-datasheet-130077068.pdf?src-supplier=NAC+Semi; ComponentLink15Description: http://datasheet.octopart.com/PTS815SJG250SMTRLFS-C%26K-Components-datasheet-130077068.pdf?src-supplier=NAC+Semi
TP1-TP4 = TP_PAD-1MM
U1 = CMP-0240-00158-1: Synchronous rectification with inhibit, 1.5 A, 1.5 MHz adjustable, step-down switching regulator, 6-Pin DFN; Manufacturer: STMicroelectronics; Min Input Voltage: 2.7V; Number of Outputs: 1; Output Current: 1.5A; Output Voltage: 3.3V; Max Supply Voltage: 6V; Switching Frequency: 1.5MHz; Output Type: Fixed,Adjustable; Quiescent Current: 1.5mA; Efficiency: 90%; Synchronous Rectifier: Yes; Polarity: Positive; Accuracy: 2%; PackageDescription: 6-Pin Plastic, Dual LLP, 3 x 3 mm Body, 0.95 mm Pitch, Exposed Pad; ComponentLink1URL: http://www.st.com; DatasheetVersion: May-2009; ComponentLink2Description: Datasheet; ComponentLink2URL: http://www.st.com/internet/com/TECHNICAL_RESOURCES/TECHNICAL_LITERATURE/DATASHEET/CD00100211.pdf; PackageVersion: 2008; PackageReference: DFN6D; ComponentLink1Description: Manufacturer URL; Supplier: Digikey; Supplier Part Number: 497-6311-1-ND; Manufacturer Part Number: ST1S06PU33R; RoHS: Yes; Category: Voltage Regulators - Switching; Stock: 5274; Pricing: 1=1.46, 10=1.306, 25=1.2392, 100=1.0179, 250=0.95156, 500=0.8409, 1000=0.66387 (USD); Mounting Technology: Surface Mount; Case/Package: DFN; Pins: 6; Weight: 0.000744oz; Min Operating Temperature: -30°C; Max Operating Temperature: 125°C; Packaging: Tape and Reel; Max Output current: 1.5A; Series: -; Package Quantity: 1; Operating Supply Voltage: 6V; Frequency: 1.5MHz; Length: 3.1mm; Width: 3.1mm; Height: 0.95mm; Radiation Hardening: No; Lead Free: Lead Free; RoHS Compliant: Yes; ComponentLink3URL: https://datasheet.ciiva.com/15113/getdatasheetpartid-188384-15113793.pdf?src-supplier=Verical; ComponentLink3Description: https://datasheet.ciiva.com/15113/getdatasheetpartid-188384-15113793.pdf?src-supplier=Verical; ComponentLink4URL: https://datasheet.ciiva.com/2029/cd00100211-2029328.pdf?src-supplier=Digikey; ComponentLink4Description: https://datasheet.ciiva.com/2029/cd00100211-2029328.pdf?src-supplier=Digikey; ComponentLink5URL: https://datasheet.ciiva.com/2029/cd00100211-2029329.pdf?src-supplier=Digikey; ComponentLink5Description: https://datasheet.ciiva.com/2029/cd00100211-2029329.pdf?src-supplier=Digikey; ComponentLink6URL: https://datasheet.ciiva.com/2029/cd00100211-2029330.pdf?src-supplier=Digikey; ComponentLink6Description: https://datasheet.ciiva.com/2029/cd00100211-2029330.pdf?src-supplier=Digikey; ComponentLink7URL: https://datasheet.ciiva.com/16489/cd00100211-16489901.pdf?src-supplier=Future+Electronics; ComponentLink7Description: https://datasheet.ciiva.com/16489/cd00100211-16489901.pdf?src-supplier=Future+Electronics; ComponentLink8URL: https://datasheet.ciiva.com/4905/cd00100211-4905371.pdf?src-supplier=Mouser; ComponentLink8Description: https://datasheet.ciiva.com/4905/cd00100211-4905371.pdf?src-supplier=Mouser
U2 = IC_AX88179B: Manufacturer Part Number: AX88179B
U3 = NC7WV125K8X: Integrated Circuit; Manufacturer_Name: ON Semiconductor; Datasheet Link: https://www.mouser.com/datasheet/2/308/NC7WV125-1301459.pdf; Height: 0.9mm; Manufacturer_Part_Number: NC7WV125K8X; Mouser Part Number: 512-NC7WV125K8X; Mouser Price/Stock: https://www.mouser.com/Search/Refine.aspx?Keyword=512-NC7WV125K8X; Arrow Part Number: NC7WV125K8X; Arrow Price/Stock: https://www.arrow.com/en/products/nc7wv125k8x/on-semiconductor
U4 = TG5032CGN 40.0000M-CAGHNA0: No Description Available; Mfr_Name: Epson; Copyright: Copyright (C) 2024 Ultra Librarian. All rights reserved.; Manufacturer_Part_Number: TG5032CGN 40.0000M-CAGHNA0; RefDes: RefDes; Type: DEV
X1 = XTAL_SIT5501AI-WUG33JT-10.000000: 1 MHz  60 MHz, Elite X Stratum 3E Precision Oscillator; Manufacturer_Name: SiTime; Geometry.Height: 2.2mm; Manufacturer_Part_Number: SIT5501AI-WUG33JT-10.000000; Mouser Part Number: *; Mouser Price/Stock: *; Arrow Part Number: *; Arrow Price/Stock: *; Mouser Testing Part Number: *; Mouser Testing Price/Stock: *; Datasheet Link: https://www.sitime.com/support/resource-library/datasheets/sit5501-datasheet
Y1 = CMP-27762-007871-1: Crystal 20MHz ±10ppm 10pF SMD-4 5mm x 3.2mm; Manufacturer: Abracon; ESR (Equivalent Series Resistance): 50R; Number of Pins: 4; Lead Free: Lead Free; Package Quantity: 1000; Max Operating Temperature: 60°C; Length: 5mm; Tolerance: 10ppm; RoHS Compliant: Yes; Height: 0.043inch; Min Operating Temperature: -10°C; Depth: 3.2mm; Series: ABM3B; Termination: SMD/SMT; Frequency Stability: 10ppm; Width: 0.126inch; Mount: Surface Mount; Case/Package: CSMD; Frequency Tolerance: 10ppm; Frequency: 20MHz; REACH SVHC: No SVHC; Resistor Type: Ceramic; Packaging: Tape and Reel; Operating Frequency: 20 MHz; Load Capacitance: 10pF; Supplier: Digikey; Supplier Part Number: 300-8214-1-ND; Manufacturer Part Number: ABM3B-20.000MHZ-10-1-U-T; RoHS: Yes; Category: Crystals; Stock: 52539; Pricing: 1=0.92, 10=0.813, 50=0.7602, 100=0.6718, 500=0.63642 (USD); Mounting Technology: Surface Mount; Pins: 4; Reach SVHC Compliant: No; ComponentLink1URL: https://datasheet.ciiva.com/15116/getdatasheetpartid-719810-15116718.pdf?src-supplier=Verical; ComponentLink1Description: https://datasheet.ciiva.com/15116/getdatasheetpartid-719810-15116718.pdf?src-supplier=Verical; ComponentLink2URL: https://datasheet.ciiva.com/4944/abm3b-39910-4944991.pdf?src-supplier=Mouser; ComponentLink2Description: https://datasheet.ciiva.com/4944/abm3b-39910-4944991.pdf?src-supplier=Mouser; ComponentLink3URL: https://datasheet.ciiva.com/858/abm3b-858647.pdf?src-supplier=Digikey; ComponentLink3Description: https://datasheet.ciiva.com/858/abm3b-858647.pdf?src-supplier=Digikey; ComponentLink4URL: https://datasheet.ciiva.com/858/abm3b-858648.pdf?src-supplier=Digikey; ComponentLink4Description: https://datasheet.ciiva.com/858/abm3b-858648.pdf?src-supplier=Digikey; ComponentLink5URL: https://datasheet.ciiva.com/858/abm3b-858649.pdf?src-supplier=Digikey; ComponentLink5Description: https://datasheet.ciiva.com/858/abm3b-858649.pdf?src-supplier=Digikey; ComponentLink6URL: https://datasheet.ciiva.com/3175/abm3b-3175832.pdf?src-supplier=Avnet; ComponentLink6Description: https://datasheet.ciiva.com/3175/abm3b-3175832.pdf?src-supplier=Avnet